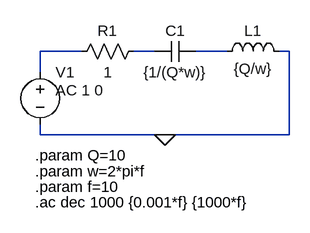
[diagram p0: schematic RLC serie.asc]
RLC serie.asc, the LTspice schematic file:
Version 4
SHEET 1 880 680
WIRE 112 80 48 80
WIRE 224 80 192 80
WIRE 336 80 288 80
WIRE 432 80 416 80
WIRE 48 112 48 80
WIRE 48 208 48 192
WIRE 240 208 48 208
WIRE 432 208 432 80
WIRE 432 208 240 208
FLAG 240 208 0
SYMBOL voltage 48 96 R0
WINDOW 3 36 73 Left 2
WINDOW 123 24 44 Left 2
WINDOW 39 0 0 Left 0
SYMATTR Value ""
SYMATTR Value2 AC 1 0
SYMATTR InstName V1
SYMBOL res 208 64 R90
WINDOW 0 0 56 VBottom 2
WINDOW 3 32 56 VTop 2
SYMATTR InstName R1
SYMATTR Value 1
SYMBOL cap 288 64 R90
WINDOW 0 0 32 VBottom 2
WINDOW 3 32 32 VTop 2
SYMATTR InstName C1
SYMATTR Value {1/(Q*w)}
SYMBOL ind 320 96 R270
WINDOW 0 32 56 VTop 2
WINDOW 3 5 56 VBottom 2
SYMATTR InstName L1
SYMATTR Value {Q/w}
TEXT 40 240 Left 2 !.param Q=10
TEXT 40 264 Left 2 !.param w=2*pi*f
TEXT 40 288 Left 2 !.param f=10
TEXT 40 312 Left 2 !.ac dec 1000 {0.001*f} {1000*f}

The netlist it stands for:
* RLC serie.asc
V1 N001 0 AC 1 0
R1 N002 N001 1
C1 N003 N002 {1/(Q*w)}
L1 N003 0 {Q/w}
.param Q=10
.param w=2*pi*f
.param f=10
.ac dec 1000 {0.001*f} {1000*f}
.backanno
.end